# EAGLE design rev1 (EAGLE 6.5.0)
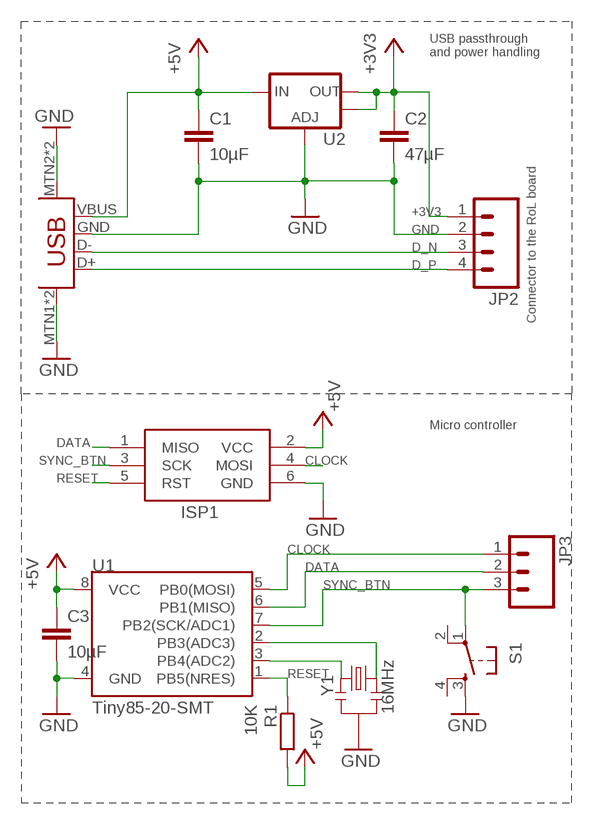
[diagram p0: schematic, sheet 1]

## Parts
C1  10µF  C-EUC3216  [C3216]
C2  47µF  C-EUC3216  [C3216]
C3  10µF  C-EUC3216  [C3216]
ISP1  AVRISP-6  [AVRISP]
JP1  USBSMD  [USB-MINIB]
JP2  M04LOCK  [1X04_LOCK]
JP3  M03LOCK  [1X03_LOCK]
R1  10K  R-EU_R0603  [R0603]
S1  TAC_SWITCHPTH  [TACTILE-PTH]
U1  Tiny85-20-SMT  ATTINY45TINY85-20-SMT  [SO08-EIAJ]
U2  V_REG_LM1117SOT223  [SOT223]
Y1  16MHz  RESONATORSMD  [RESONATOR-SMD]

## Nets
+3V3: C2.1 JP2.1 U2.2(OUT) U2.4(OUT)
+5V: C1.1 C3.1 ISP1.2(VCC) JP1.VBUS R1.2 U1.8(VCC) U2.3(IN)
CLOCK: ISP1.4(MOSI) JP3.1 U1.5(PB0(MOSI))
D_N: JP1.D- JP2.3
D_P: JP1.D+ JP2.4
DATA: ISP1.1(MISO) JP3.2 U1.6(PB1(MISO))
GND: C1.2 C2.2 C3.2 ISP1.6(GND) JP1.GND JP1.MTN1(MNT) JP1.MTN2(MNT2) JP1.MTN3(MNT2) JP1.MTN4(MNT) JP2.2 S1.3 U1.4(GND) U2.1(ADJ) Y1.2
N$1: U1.2(PB3(ADC3)) Y1.3
N$2: U1.3(PB4(ADC2)) Y1.1
RESET: ISP1.5(RST) R1.1 U1.1(PB5(NRES))
SYNC_BTN: ISP1.3(SCK) JP3.3 S1.1 U1.7(PB2(SCK/ADC1))
Unconnected: S1.2 S1.4

## Notes on the sheet
- USB passthrough
  and power handling
- Connector to the RoL board
- Micro controller

## Library data of the parts
C1-C3 = resistor:C-EU: CAPACITOR, European symbol
ISP1 = adafruit:AVRISP: AVR ISP HEADER Standard 6 pin header for AVR programming
JP1 = SparkFun-Connectors:USB: USB Connectors USB-B-PTH is fully proven SKU : PRT-00139/CONN-08278 USB-miniB is fully proven SKU : PRT-00587 USB-A-PCB is untested. USB-A-H is throughly reviewed, but untested. Spark Fun Electronics SKU : PRT-00437 USB-B-SMT is throughly reviewed, but untested. Needs silkscreen touching up. USB-A-S has not been used/tested USB-MB-H has not been used/tested USB-MICROB has been used. CONN-09505
JP2 = SparkFun-Connectors:M04: Header 4 Standard 4-pin 0.1" header. Use with straight break away headers (SKU : PRT-00116), right angle break away headers (PRT-00553), swiss pins (PRT-00743), machine pins (PRT-00117), and female headers (PRT-00115). Molex polarized connector foot print use with SKU : PRT-08231 with associated crimp pins and housings. 1MM SMD Version SKU: PRT-10208
JP3 = SparkFun-Connectors:M03: Header 3 Standard 3-pin 0.1" header. Use with straight break away headers (SKU : PRT-00116), right angle break away headers (PRT-00553), swiss pins (PRT-00743), machine pins (PRT-00117), and female headers (PRT-00115). Molex polarized connector foot print use with SKU : PRT-08232 with associated crimp pins and housings.
R1 = resistor:R-EU_: RESISTOR, European symbol
S1 = SparkFun-Electromechanical:TAC_SWITCH: Momentary Switch Button commonly used for reset or general input. Spark Fun Electronics SKU : COM-00097 SMT- SWCH-08247
U1 = SparkFun-DigitalIC:ATTINY45: Atmel 8-pin 2/4/8kB flash uC; PROD_ID: IC-09092
U2 = SparkFun-PowerIC:V_REG_LM1117: Voltage Regulator LM1117 Standard adjustable voltage regulator but in SMD form. Spark Fun Electronics SKU : COM-00595
Y1 = LowPowerLab:RESONATOR: Resonator Small SMD resonator. This is the itty bitty 10/20MHz resonators with built in caps. CSTCE10M0G55 and CSTCE20M0V53. Footprint has been reviewed closely but hasn't been tested yet.

## Board
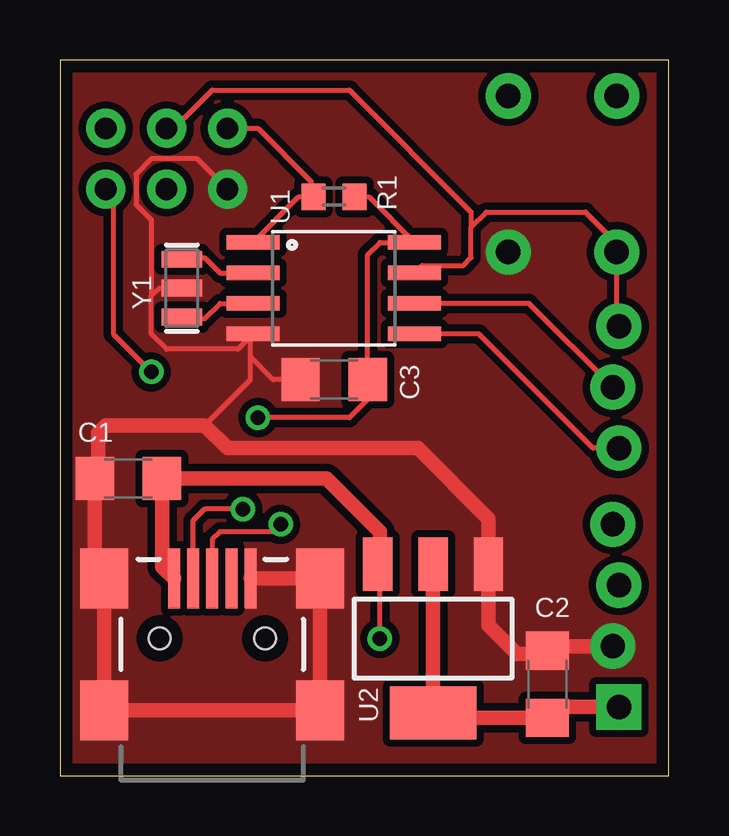
[diagram p1: board, top side]
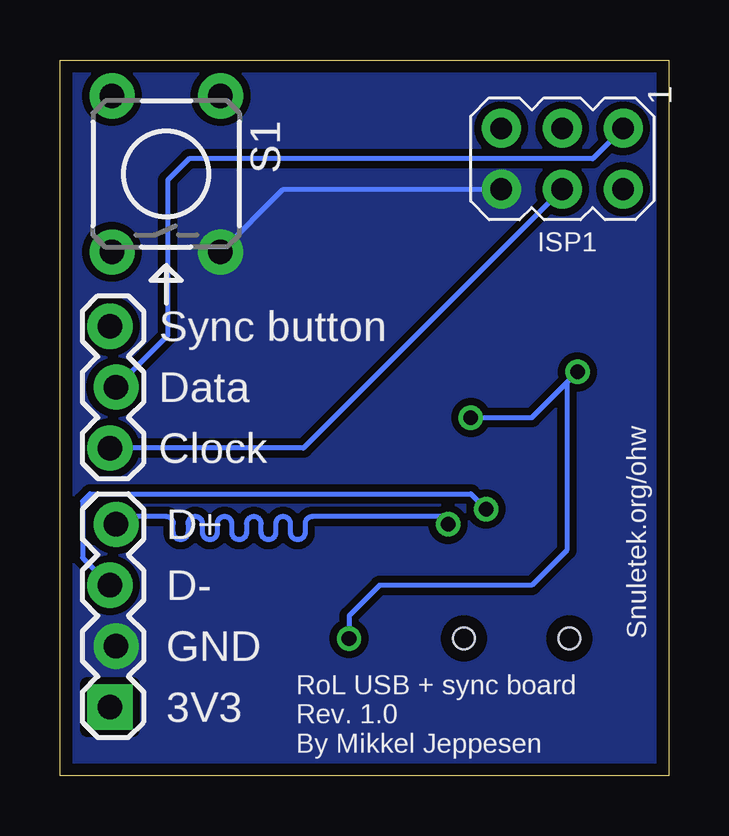
[diagram p2: board, bottom side, seen from below]

Size 25.39 x 29.84 mm. Coordinates in mm from the lower left corner, seen from the top.
Outline: 0,0 25.39,0 25.39,29.84 0,29.84 0,0
Copper layers (1*16): Top 0.035mm / dielectric 1.5mm / Bottom 0.035mm
Design rules "OSH park": minimum track width 6mil, minimum drill 13mil, track to track 6mil, track to pad 6mil, pad to pad 6mil, via to via 6mil, smd to smd 6mil, copper to edge 20mil, drill to drill 16mil, minimum pad ring 10mil, minimum via ring 8mil, stop-mask expansion 4mil, vias tented up to drill 0mil, thermal gap 16mil

### Footprints (pad centres in the part's own frame; a part is rotated, then mirrored left to right if it is on the bottom)
C3216 = smd 1.6 x 1.8: 1 -1.4,0; 2 1.4,0
AVRISP = drill 0.9 pad 1.626: 1 -1.27,2.54; 2 1.27,2.54; 3 -1.27,0; 4 1.27,0; 5 -1.27,-2.54; 6 1.27,-2.54
USB-MINIB = smd 2.5 x 0.5: D+ 2.5,0; D- 2.5,0.8; GND 2.5,-1.6; ID 2.5,-0.8; VBUS 2.5,1.6 | smd 2.5 x 2: MTN1 -3,4.5; MTN2 2.5,4.5; MTN3 -3,-4.5; MTN4 2.5,-4.5 | hole 0.9: 0,2.2; 0,-2.2
1X04_LOCK = drill 1.016 pad 1.88 square: 1 0,0.127 | drill 1.016 pad 1.88: 2 2.54,-0.127; 3 5.08,0.127; 4 7.62,-0.127
1X03_LOCK = drill 1.016 pad 1.88: 1 0,0.127; 2 2.54,-0.127; 3 5.08,0.127
R0603 = smd 1 x 1.1: 1 -0.85,0; 2 0.85,0
TACTILE-PTH = drill 1.016 pad 1.88: 1 -3.251,2.261; 2 3.251,2.261; 3 -3.251,-2.261; 4 3.251,-2.261
SO08-EIAJ = smd 0.61 x 2.21: 1 -1.905,-3.378; 2 -0.635,-3.378; 3 0.635,-3.378; 4 1.905,-3.378; 5 1.905,3.353; 6 0.635,3.353; 7 -0.635,3.353; 8 -1.905,3.353
SOT223 = smd 1.219 x 2.235: 1 -2.311,-3.099; 2 0,-3.099; 3 2.311,-3.099 | smd 3.6 x 2.2: 4 0,3.099
RESONATOR-SMD = smd 0.7 x 1.7: 1 -1.2,0; 2 0,0; 3 1.2,0

### Placement (x,y rotation side)
C1  2.86,12.38 180 top
C2  20.32,3.81 90 top
C3  11.43,16.51 180 top
ISP1  4.45,25.72 270 bottom
JP1  6.35,5.71 90 top
JP2  23.18,2.86 90 bottom
JP3  23.18,13.65 90 bottom
R1  11.43,24.13 0 top
S1  20.95,25.08 90 bottom
U1  11.43,20.32 270 top
U2  15.56,5.71 180 top
Y1  5.08,20.32 90 top

### Tracks (layer width: path | path; a pad name or v marks a point on that pad's centre or on a via)
+3V3
  Top 0.61: U2.2 U2.4 15.76,2.41 C2.1 20.77,2.86 JP2.1
+5V  (via drill 0.61)
  Top 0.203: R1.2 12.88,24.13 U1.8 13.34,22.23 12.83,21.72 C3.1 12.83,15.69 12.06,14.92 v8.26,14.92 | ISP1.2 2.22,24.13 2.22,18.41 v3.81,16.83 | v13.34,5.71 13.34,8.72 U2.3
  Top 0.61: U2.3 13.34,8.9 13.34,10.16 11.11,12.38 C1.1 4.26,8.71 JP1.VBUS
  Bottom 0.203: v13.34,5.71 13.34,6.67 12.06,7.94 5.71,7.94 4.26,9.39 4.26,16.38 v3.81,16.83 5.71,14.92 v8.26,14.92
CLOCK
  Top 0.203: JP3.1 22.23,13.65 17.46,18.41 U1.5
  Bottom 0.203: ISP1.4 15.24,13.65 JP3.1
D_N  (via drill 0.61)
  Top 0.203: JP1.D- 5.55,10.63 6.03,11.11 v7.62,11.11
  Bottom 0.203: v7.62,11.11 8.26,11.75 24.13,11.75 24.45,11.43 24.45,9.08 JP2.3
D_P  (via drill 0.61)
  Top 0.203: v9.21,10.48 8.89,10.16 6.67,10.16 6.35,9.84 JP1.D+
  Bottom 0.203: v9.21,10.48 9.53,10.79 14.88,10.79 arc-90 15.17,10.5 15.17,10.13 arc90 15.46,9.84 15.48,9.84 arc90 15.78,10.13 15.78,10.5 arc-90 16.07,10.79 16.1,10.79 arc-90 16.39,10.5 16.39,10.13 arc90 16.68,9.84 16.71,9.84 arc90 17,10.13 17,10.5 arc-90 17.29,10.79 17.32,10.79 arc-90 17.61,10.5 17.61,10.13 arc90 17.9,9.84 17.93,9.84 arc90 18.22,10.13 18.22,10.5 arc-90 18.51,10.79 18.54,10.79 arc-90 18.83,10.5 18.83,10.13 arc90 19.12,9.84 19.15,9.84 arc90 19.44,10.13 19.44,10.5 arc-90 19.73,10.79 19.76,10.79 arc-90 20.05,10.5 20.05,10.13 arc90 20.34,9.84 20.37,9.84 arc90 20.66,10.13 20.66,10.5 arc-90 20.95,10.79 22.73,10.79 JP2.4
DATA
  Top 0.203: JP3.2 19.56,19.68 U1.6
  Bottom 0.203: ISP1.1 3.17,25.72 20,25.72 20.89,24.83 20.89,18.35 JP3.2
GND
  Top 0.203: C3.2 8.89,16.51 7.94,17.46 | 7.94,17.46 7.94,18.3 | 7.94,18.3 U1.4 | 7.94,18.3 7.42,17.78 4.45,17.78 3.81,18.41 3.81,20 | 3.81,20 4.13,20.32 Y1.2 | ISP1.6 5.71,25.72 3.81,25.72 3.17,25.08 3.17,23.81 3.81,23.18 3.81,20 | 6.03,14.61 7.94,16.51 7.94,17.46
  Top 0.61: JP1.GND JP1.MTN4 JP1.MTN3 JP1.MTN1 JP1.MTN2 1.46,8.61 C1.2 1.59,12.51 1.59,14.29 1.91,14.61 6.03,14.61 6.99,13.65 14.92,13.65 17.87,10.71 U2.1 17.87,6.26 19.05,5.08 20.19,5.08 C2.2 20.51,5.4 JP2.2
  Bottom 0.203: S1.3 16.08,24.45 ISP1.6
  pour Top (isolate 0.305, no thermals): 0,29.84 0,0 25.4,0 25.4,29.84
  pour Bottom (isolate 0.305, no thermals): 0,29.84 0,0 25.4,0 25.4,29.84
N$1
  Top 0.203: Y1.3 5.15,21.59 6.03,21.59 6.67,20.95 U1.2
N$2
  Top 0.203: Y1.1 5.15,19.05 6.03,19.05 6.67,19.68 U1.3
RESET
  Top 0.203: U1.1 9.96,24.13 R1.1 10.48,24.23 10.48,24.77 8.26,26.99 ISP1.5
SYNC_BTN
  Top 0.203: JP3.3 23.22,18.82 S1.1 23.22,22.19 21.91,23.5 17.78,23.5 17.14,22.86 | U1.7 15.1,21.27 16.83,21.27 17.14,21.59 17.14,22.86 | ISP1.3 4.76,26.99 6.35,28.57 12.06,28.57 17.14,23.5 17.14,22.86

### Text on the board
bPlace: Sync button | Data | Clock | D+ | D- | Snuletek.org/ohw | GND | 3V3 | RoL USB + sync board / Rev. 1.0 / By Mikkel Jeppesen